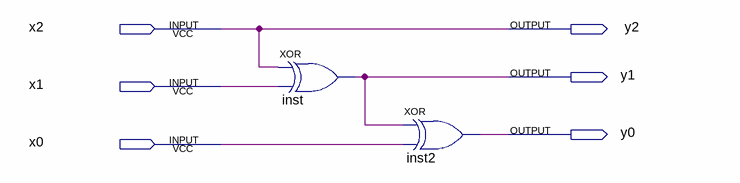
[diagram p0: schematic sheet]
// Quartus schematic Problema2.bdf as structural Verilog: 2 symbols, 6 pins
module Problema2 (
  input  x2,
  input  x1,
  input  x0,
  output y2,
  output y1,
  output y0
);

  xor inst (y1, x2, x1);
  xor inst2 (y0, y1, x0);

  assign y2 = x2;
endmodule
